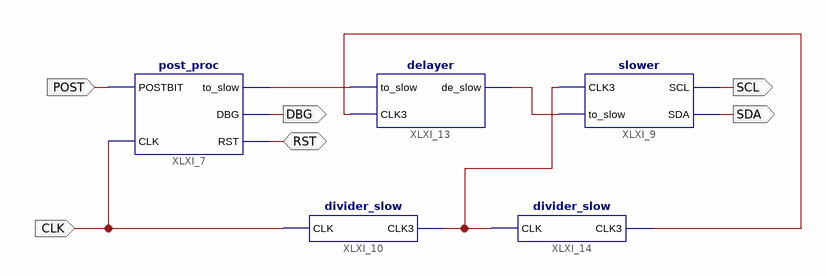
[diagram p0: schematic sheet 1]
// Xilinx ISE schematic overall.sch (xbr) as structural Verilog: 5 symbols, 6 ports
module overall (
  input  CLK,
  input  POST,
  inout  RST,
  output DBG,
  output SCL,
  output SDA
);

  wire XLXN_70, XLXN_72, XLXN_73, XLXN_74;

  post_proc XLXI_7 (.POSTBIT(POST), .CLK(CLK), .to_slow(XLXN_70), .DBG(DBG), .RST(RST));
  slower XLXI_9 (.CLK3(XLXN_72), .to_slow(XLXN_73), .SCL(SCL), .SDA(SDA));
  divider_slow XLXI_10 (.CLK(CLK), .CLK3(XLXN_72));
  delayer XLXI_13 (.to_slow(XLXN_70), .CLK3(XLXN_74), .de_slow(XLXN_73));
  divider_slow XLXI_14 (.CLK(XLXN_72), .CLK3(XLXN_74));
endmodule
